# Altium schematic sheet DEBUGGER RIG.SchDoc
size A1
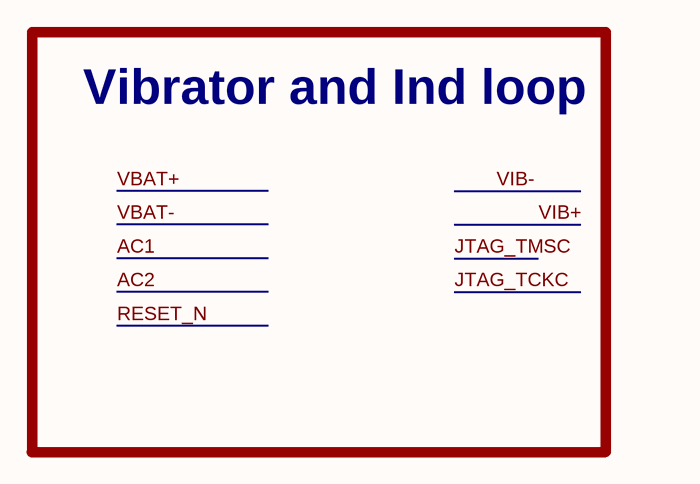
[diagram p0: DEBUGGER RIG.SchDoc]

## Notes on the sheet
- Vibrator and Ind loop